# Altium schematic sheet [02] Block Diagram.SchDoc: Block Diagram
size A4; Organization: Blinkinlabs, LLC; DocumentNumber: 2; SheetNumber: 2; SheetTotal: 4
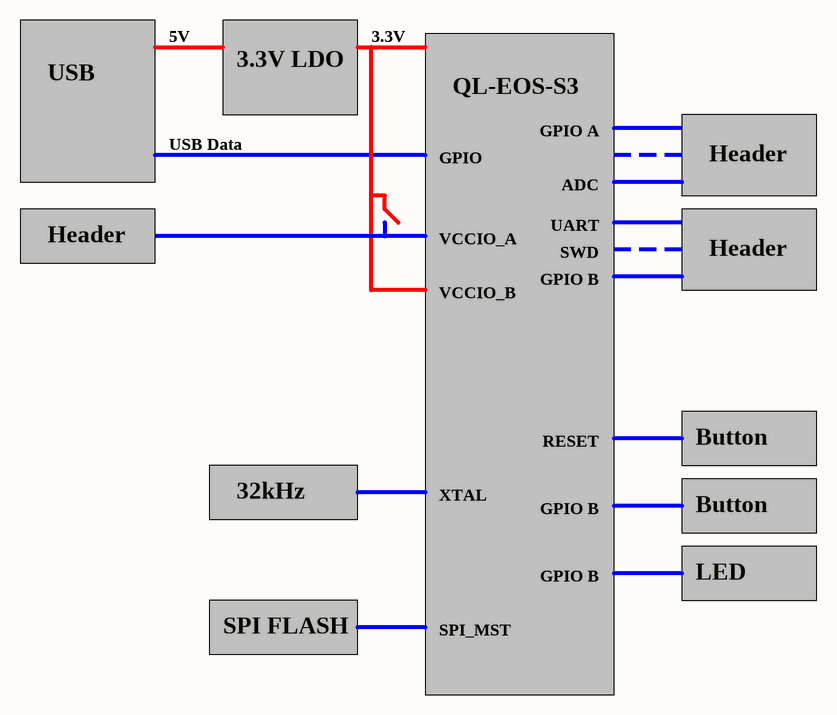
[diagram p0: [02] Block Diagram.SchDoc]

## Notes on the sheet
- USB
- 5V
- 3.3V LDO
- 3.3V
- USB Data
- QL-EOS-S3
- GPIO A
- GPIO
- ADC
- Header
- VCCIO_A
- GPIO B
- UART
- SWD
- VCCIO_B
- RESET
- Button
- 32kHz
- XTAL
- LED
- SPI FLASH
- SPI_MST
- Title:
- Project:
- Revision:
- Date:
- Time:
- Sheet
- of